# EAGLE design 04B-352 (EAGLE 9.6.2)
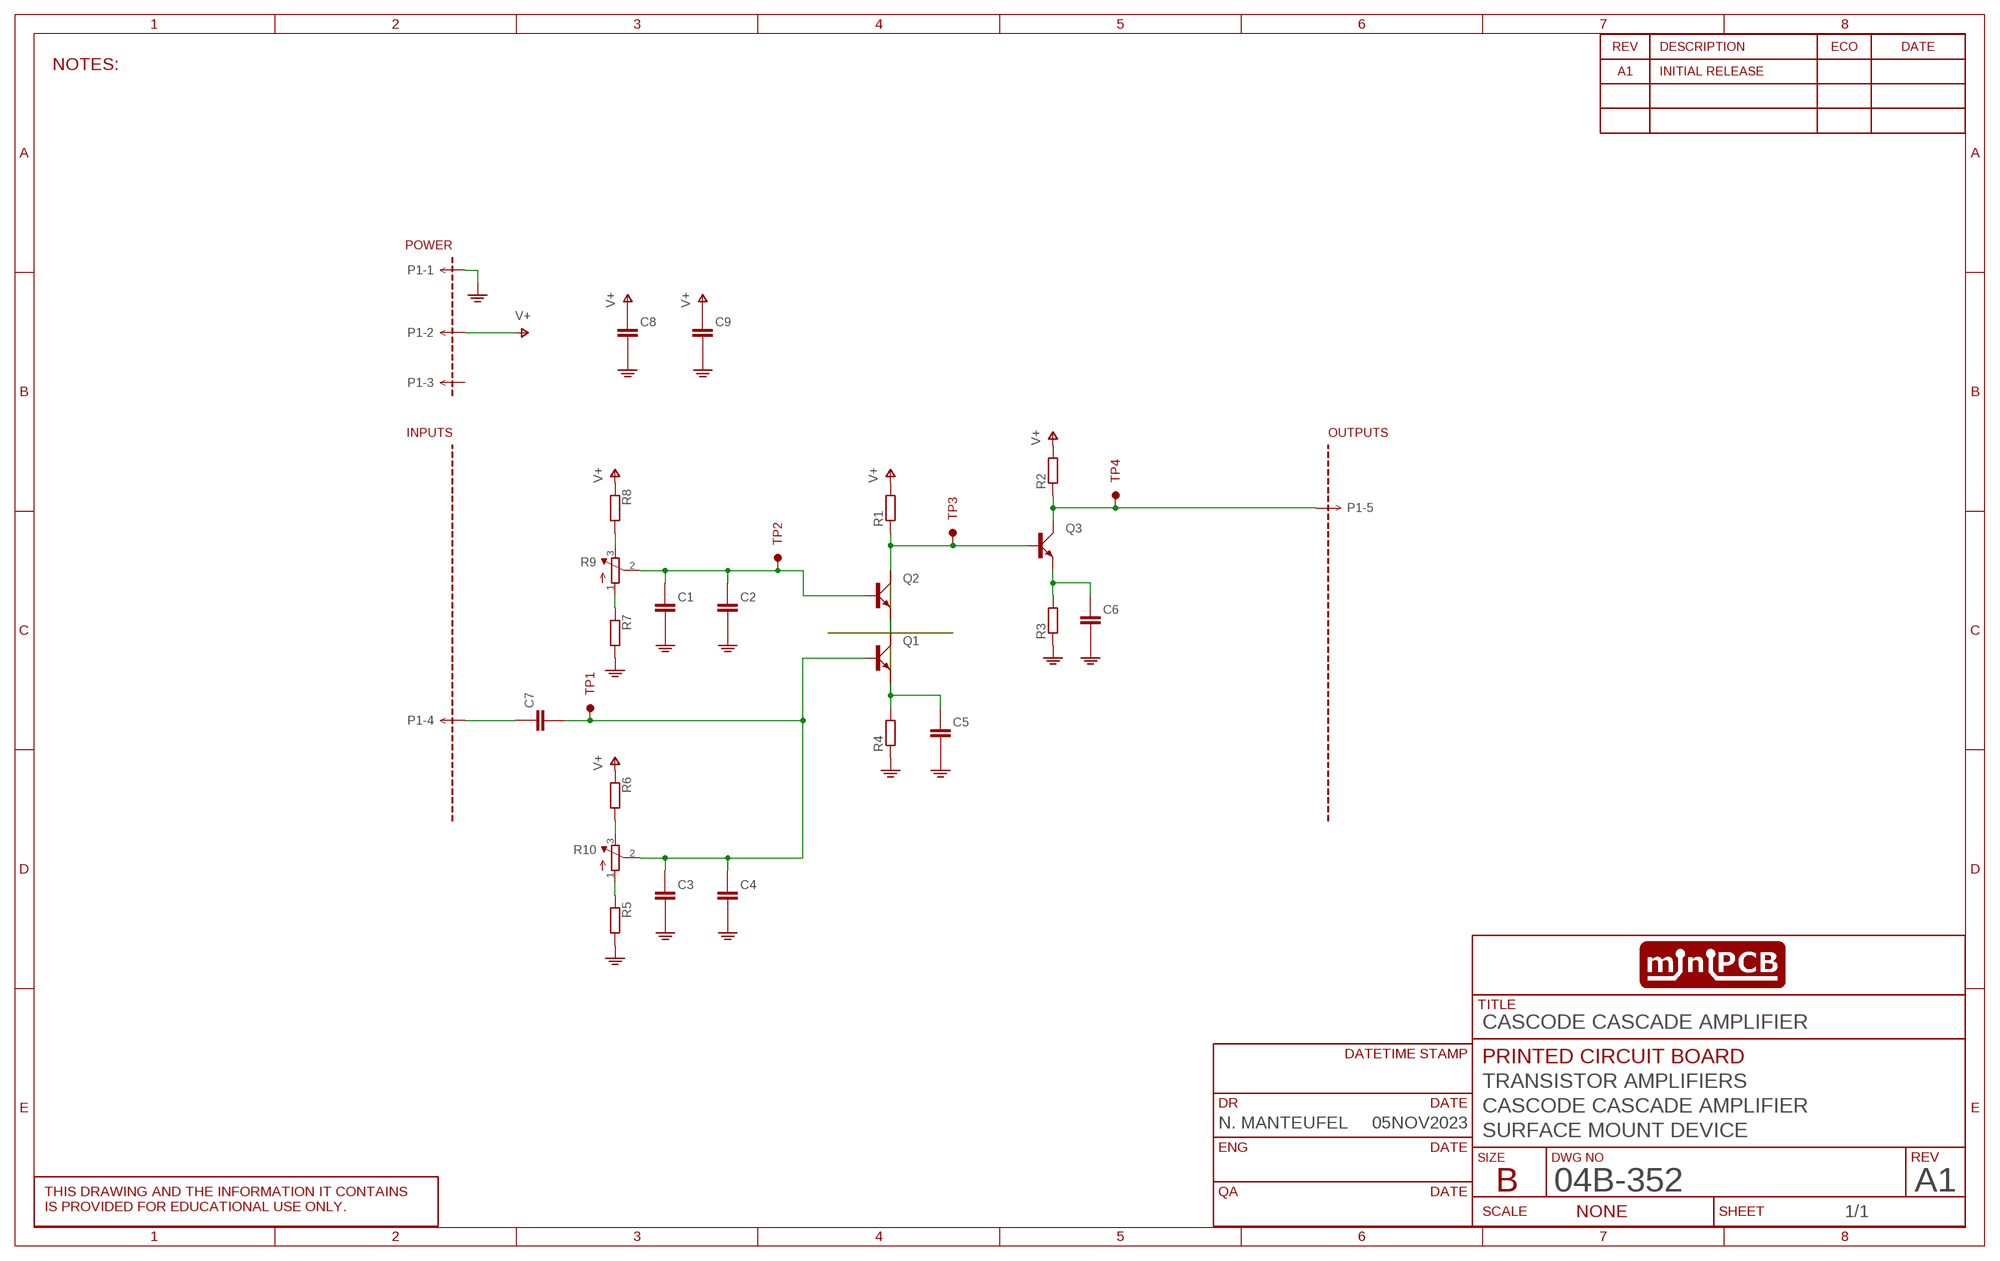
[diagram p0: schematic, sheet 1]
SHEET1 (SCHEMATIC): CIRCUIT_CATEGORY: TRANSISTOR AMPLIFIERS; CIRCUIT_NAME: CASCODE CASCADE AMPLIFIER; CIRCUIT_VARIANT: SURFACE MOUNT DEVICE; DR: N. MANTEUFEL; DR_DATE: 05NOV2023; PCB_PCBA: PRINTED CIRCUIT BOARD; REVA: A1; REVISION: A1; TITLE: CASCODE CASCADE AMPLIFIER

## Parts
C1  CAPACITORSMD  [C0805]
C2  CAPACITORSMD  [C0805]
C3  CAPACITORSMD  [C0805]
C4  CAPACITORSMD  [C0805]
C5  CAPACITORSMD  [C0805]
C6  CAPACITORSMD  [C0805]
C7  CAPACITORSMD  [C0805]
C8  CAPACITORSMD  [C0805]
C9  CAPACITORSMD  [C0805]
P1  MINIPCB_5P5P  [PINS_1X5]
PCB1  MINIPCB_0P25X50  [MINIPCB_0P_25X50]
Q1  BJT_NPNBEC  [SOT23]
Q2  BJT_NPNBEC  [SOT23]
Q3  BJT_NPNBEC  [SOT23]
R1  RESISTORSMD  [R0805]
R2  RESISTORSMD  [R0805]
R3  RESISTORSMD  [R0805]
R4  RESISTORSMD  [R0805]
R5  RESISTORSMD  [R0805]
R6  RESISTORSMD  [R0805]
R7  RESISTORSMD  [R0805]
R8  RESISTORSMD  [R0805]
R9  TRIMPOT0.100THD  [TRIM_0100]
R10  TRIMPOT0.100THD  [TRIM_0100]
TP1  TESTPOINTKE5000-SMTEXT  [PINS_1_TESTPOINT_KE5000_NOTEXT]
TP2  TESTPOINTKE5000-SMTEXT  [PINS_1_TESTPOINT_KE5000_NOTEXT]
TP3  TESTPOINTKE5000-SMTEXT  [PINS_1_TESTPOINT_KE5000_NOTEXT]
TP4  TESTPOINTKE5000-SMTEXT  [PINS_1_TESTPOINT_KE5000_NOTEXT]

## Nets
GND: C1.2(-) C2.2(-) C3.2(-) C4.2(-) C5.2(-) C6.2(-) C8.2(-) C9.2(-) P1.1 R3.1 R4.1 R5.2 R7.2
N$1: R6.2 R10.3(E)
N$2: R5.1 R10.1(A)
N$3: R7.1 R9.1(A)
N$4: R8.2 R9.3(E)
N$5: C1.1(+) C2.1(+) Q2.1(B) R9.2(S) TP2.1
N$6: C3.1(+) C4.1(+) C7.2(-) Q1.1(B) R10.2(S) TP1.1
N$7: C5.1(+) Q1.2(E) R4.2
N$8: C6.1(+) Q3.2(E) R3.2
N$9: Q1.3(C) Q2.2(E)
N$10: Q2.3(C) Q3.1(B) R1.1 TP3.1
N$11: C7.1(+) P1.4
N$12: P1.5 Q3.3(C) R2.1 TP4.1
V+: C8.1(+) C9.1(+) P1.2 R1.2 R2.2 R6.1 R8.1
Unconnected: P1.3

## Notes on the sheet
- NOTES:

## Library data of the parts
C1-C9 = minipcb:CAPACITOR
P1 = minipcb:MINIPCB_5P
PCB1 = minipcb:MINIPCB_0P; PART_NUMBER: 04B-352; REVISION: A1-01; TITLE: CASCODE CASCADE AMPLIFIERS
Q1-Q3 = minipcb:BJT_NPN: TRANSISTOR
R1-R8 = minipcb:RESISTOR
R9 R10 = minipcb:TRIMPOT: SMT trimmer potentiometer part number TC33X http://www.ladyada.net/library/eagle
TP1-TP4 = minipcb:TESTPOINT

## Board
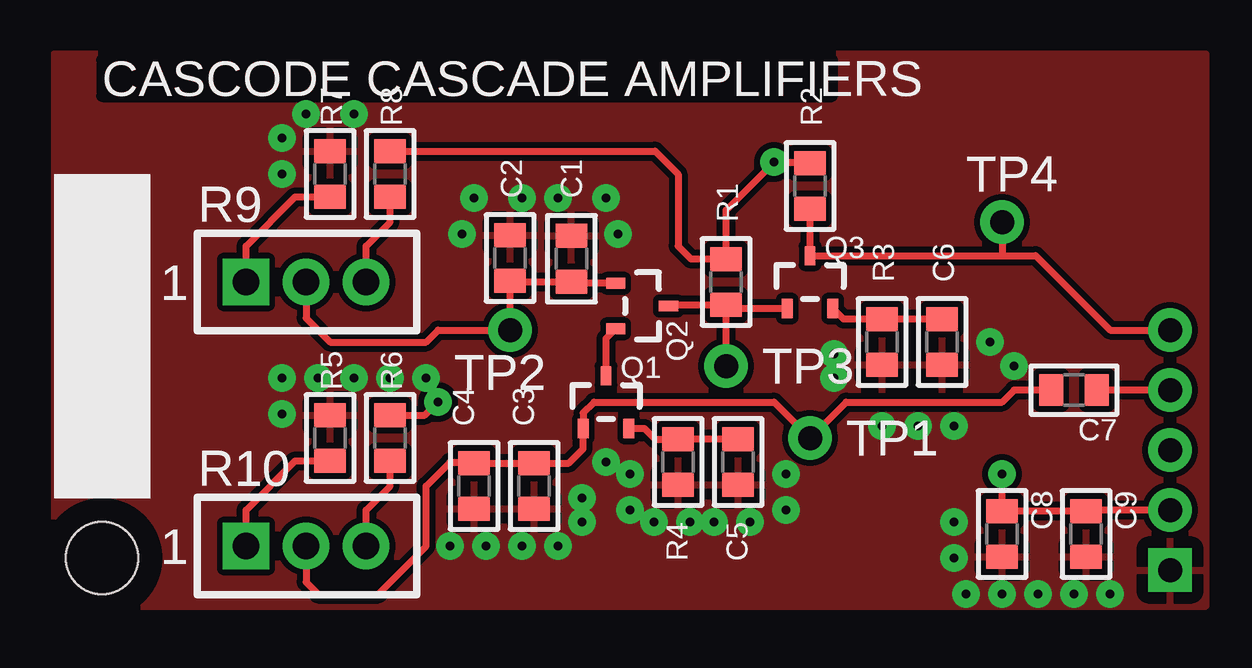
[diagram p1: board, top side]
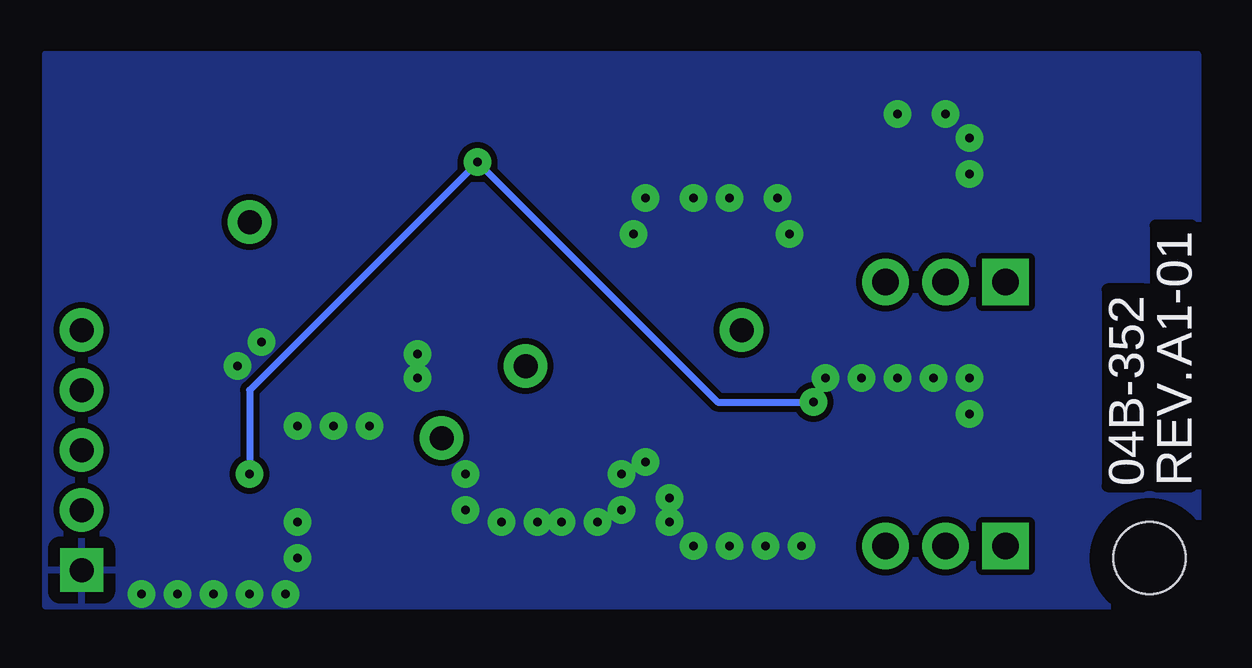
[diagram p2: board, bottom side, seen from below]

No outline drawn. Coordinates in mm, seen from the top.
Copper layers (1*16): Top 0.035mm / dielectric 1.5mm / Bottom 0.035mm
Design rules "minipcb": minimum track width 0.2mm, minimum drill 0.5mm, track to track 0.25mm, track to pad 0.5mm, pad to pad 0.5mm, via to via 0.5mm, smd to smd 0.15mm, copper to edge 1mm, drill to drill 1mm, minimum pad ring 0.4mm, minimum via ring 0.4mm, stop-mask expansion 0.1mm, vias tented up to drill 0.6mm, thermal gap 0.5mm

### Footprints (pad centres in the part's own frame; a part is rotated, then mirrored left to right if it is on the bottom)
C0805 = smd 1 x 1.3: 1 -0.95,0; 2 0.95,0
PINS_1X5 = drill 1 square: 1 0,0 | drill 1: 2 2.5,0; 3 5,0; 4 7.5,0; 5 10,0
MINIPCB_0P_25X50 = hole 3: 3,3
SOT23 = smd 0.45 x 0.8: 1 -0.95,-1.1; 2 0.95,-1.1; 3 0,1.1
R0805 = smd 1 x 1.3: 1 -0.95,0; 2 0.95,0
TRIM_0100 = drill 1.1 pad 1.93 square: 1 0,0 | drill 1.1 pad 1.93: 2 2.5,0; 3 5,0
PINS_1_TESTPOINT_KE5000_NOTEXT = drill 1: 1 0,0

### Placement (x,y rotation side)
C1  22.56,15.47 90 top
C2  20,15.5 90 top
C3  21,6 270 top
C4  18.5,6 270 top
C5  29.5,7 270 top
C6  38,12 270 top
C7  43.5,10 180 top
C8  40.5,4 270 top
C9  44,4 270 top
P1  47.5,2.5 90 top
PCB1  0,0 0 top
Q1  24,9.5 0 top
Q2  25.5,13.5 270 top
Q3  32.5,14.5 0 top
R1  29,14.5 90 top
R2  32.5,18.5 90 top
R3  35.5,12 90 top
R4  27,7 90 top
R5  12.5,8 90 top
R6  15,8 270 top
R7  12.5,19 90 top
R8  15,19 270 top
R9  9,14.5 0 top
R10  9,3.5 0 top
TP1  32.5,8 0 top
TP2  20,12.5 180 top
TP3  29,11 0 top
TP4  40.5,17 0 top

### Tracks (layer width: path | path; a pad name or v marks a point on that pad's centre or on a via)
GND  (via drill 0.35)
  other vias: 17.5,3.5 19,3.5 20.5,3.5 22,3.5 26,4.5 27.5,4.5 28.5,4.5 30,4.5 40,12 41,11 33.5,10.5 33.5,11.5 35.5,8.5 37,8.5 38.5,8.5 18,16.5 18.5,18 20.5,18 22,18 24,18 24.5,16.5 13.5,21.5 11.5,21.5 10.5,20.5 10.5,19 23,5.5 23,4.5 10.5,9 24,7 25,6.5 25,5 31.5,6.5 31.5,5 38.5,4.5 45,1.5 43.5,1.5 42,1.5 40.5,1.5 39,1.5 38.5,3 10.5,10.5 12,10.5 13.5,10.5 15,10.5 16.5,10.5
  pour Top: 1,1 49,1 49,24 1,24
  pour Bottom: 1,1 49,1 49,24 1,24
N$1
  Top 0.3: R10.3 14,5 15,6 R6.2
N$2
  Top 0.3: R10.1 9,5 11.05,7.05 R5.1
N$3
  Top 0.3: R9.1 9,16 11.05,18.05 R7.1
N$4
  Top 0.3: R9.3 14,16 15,17 R8.2
N$5
  Top 0.3: R9.2 11.5,13 12.5,12 16.5,12 17,12.5 TP2.1 C2.1 20.03,14.52 C1.1 22.63,14.45 Q2.1
N$6
  Top 0.3: R10.2 11.5,2 12,1.5 14.5,1.5 16.5,3.5 16.5,6 17.5,7 18.45,7 C4.1 C3.1 22.45,6.95 23.05,7.55 Q1.1 23.05,9.05 23.5,9.5 31,9.5 TP1.1 34,9.5 40.5,9.5 41,10 C7.2
N$7
  Top 0.3: Q1.2 25.6,8.4 26.05,7.95 R4.2 C5.1
N$8
  Top 0.3: C6.1 R3.2 33.9,12.95 Q3.2
N$9
  Top 0.3: Q1.3 24,12.15 Q2.2
N$10
  Top 0.3: Q2.3 26.65,13.55 R1.1 | R1.1 29.15,13.4 Q3.1 | TP3.1 R1.1
N$11
  Top 0.3: P1.4 C7.1
N$12
  Top 0.3: R2.1 Q3.3 40.5,15.6 | 40.5,15.6 41.9,15.6 45,12.5 P1.5 | TP4.1 40.5,15.6
V+  (via drill 0.35)
  Top 0.3: P1.2 44.05,5 C9.1 C8.1 v40.5,6.5 | R2.2 32.45,19.5 v31,19.5 29,17.5 R1.2 27.55,15.45 27,16 27,19 26.05,19.95 R8.1 | R6.1 16.45,8.95 v17,9.5
  Bottom 0.3: v40.5,6.5 40.5,10 v31,19.5 21,9.5 v17,9.5

### Text on the board
_tNames: R7 | R8 | R2 | C2 | C1 | TP4 | R9 | R1 | Q3 | R3 | C6 | Q2 | TP2 | Q1 | R5 | R6 | TP3 | C4 | C3 | C7 | TP1 | R10 | C8 | C9 | R4 | C5